# Altium schematic sheet loud.SchDoc
size A4
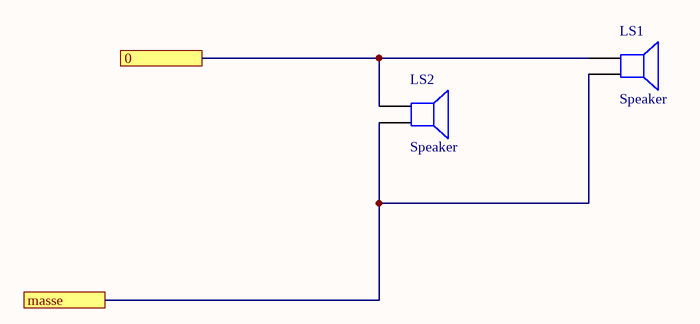
[diagram p0: loud.SchDoc]

## Parts
LS1  Speaker  [PIN2]
LS2  Speaker  [PIN2]

## Ports
0, masse

## Nets
0: LS1.1 LS2.1 ; port 0
masse: LS1.2 LS2.2 ; port masse

## Library data of the parts
LS1 LS2 = Speaker: Loudspeaker; Published: 24-Mar-1999; LatestRevisionDate: 17-Jul-2002; LatestRevisionNote: Re-released for DXP Platform.; PackageReference: PIN2; Publisher: Altium Limited